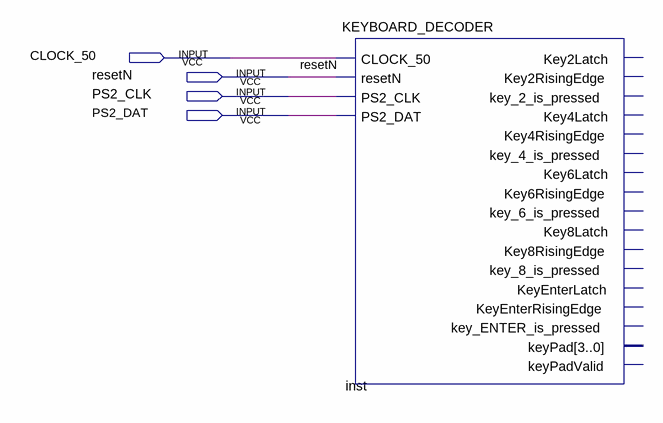
[diagram p0: schematic sheet]
// Quartus schematic KEYBOARD_INTERFACE.bdf as structural Verilog: 1 symbols, 4 pins
module KEYBOARD_INTERFACE (
  input  CLOCK_50,
  input  resetN,
  input  PS2_CLK,
  input  PS2_DAT
);

  KEYBOARD_DECODER inst (
    .CLOCK_50(CLOCK_50), .resetN(resetN), .PS2_CLK(PS2_CLK), .PS2_DAT(PS2_DAT));  // open: Key2Latch, Key2RisingEdge, key_2_is_pressed, Key4Latch, Key4RisingEdge, key_4_is_pressed, Key6Latch, Key6RisingEdge, key_6_is_pressed, Key8Latch, Key8RisingEdge, key_8_is_pressed, KeyEnterLatch, KeyEnterRisingEdge, key_ENTER_is_pressed, keyPad, keyPadValid
endmodule
